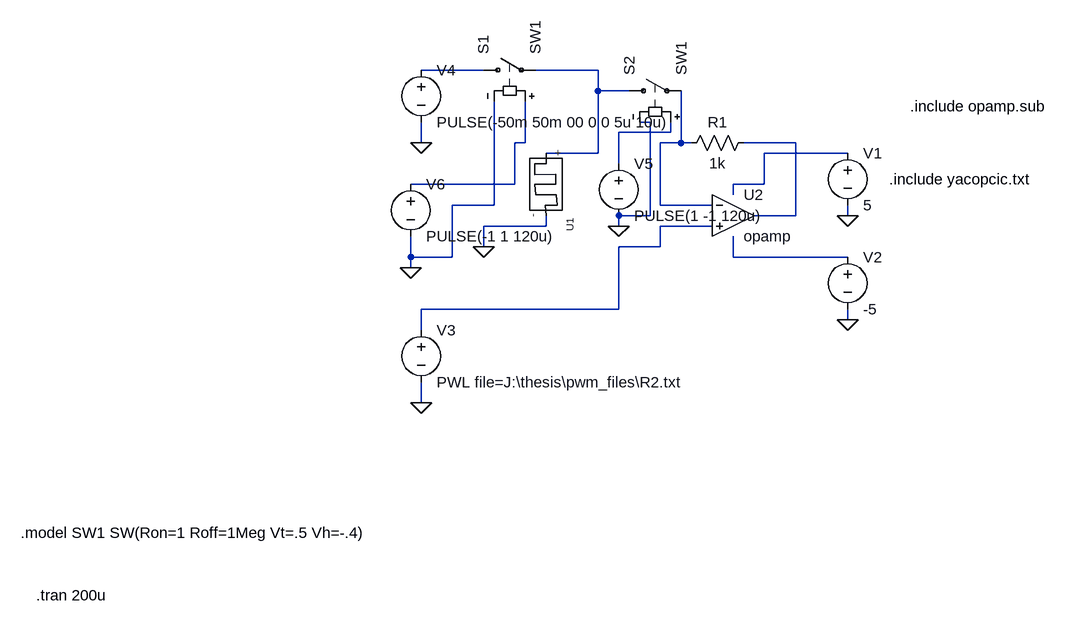
[diagram p0: schematic programmer_test.asc]
programmer_test.asc, the LTspice schematic file:
Version 4
SHEET 1 880 680
WIRE -528 -256 -624 -256
WIRE -352 -256 -448 -256
WIRE -352 -224 -352 -256
WIRE -304 -224 -352 -224
WIRE -272 -176 -288 -176
WIRE -240 -160 -240 -176
WIRE -240 -160 -320 -160
WIRE -624 -144 -624 -176
WIRE -464 -144 -464 -208
WIRE -464 -144 -480 -144
WIRE -224 -144 -224 -224
WIRE -224 -144 -256 -144
WIRE -208 -144 -224 -144
WIRE -48 -144 -128 -144
WIRE -352 -128 -352 -224
WIRE -352 -128 -432 -128
WIRE 32 -128 -96 -128
WIRE -320 -112 -320 -160
WIRE -480 -80 -480 -144
WIRE -480 -80 -640 -80
WIRE -96 -80 -96 -128
WIRE -96 -80 -144 -80
WIRE -144 -64 -144 -80
WIRE -512 -48 -512 -208
WIRE -512 -48 -576 -48
WIRE -256 -48 -256 -144
WIRE -176 -48 -256 -48
WIRE -272 -32 -272 -176
WIRE -272 -32 -320 -32
WIRE -48 -32 -48 -144
WIRE -48 -32 -112 -32
WIRE 32 -32 32 -48
WIRE -432 -16 -432 -32
WIRE -432 -16 -528 -16
WIRE -320 -16 -320 -32
WIRE -176 -16 -256 -16
WIRE -528 16 -528 -16
WIRE -256 16 -256 -16
WIRE -256 16 -320 16
WIRE -640 32 -640 0
WIRE -576 32 -576 -48
WIRE -576 32 -640 32
WIRE -144 32 -144 0
WIRE 32 32 -144 32
WIRE -640 48 -640 32
WIRE -320 112 -320 16
WIRE -320 112 -624 112
WIRE 32 128 32 112
WIRE -624 144 -624 112
WIRE -624 256 -624 224
FLAG -528 16 0
FLAG 32 -32 0
FLAG 32 128 0
FLAG -624 256 0
FLAG -640 48 0
FLAG -320 -16 0
FLAG -624 -144 0
SYMBOL memristormodel -432 -48 R90
SYMATTR InstName U1
SYMATTR Value MEM_YAKOPCIC
SYMBOL res -112 -160 R90
WINDOW 0 0 56 VBottom 2
WINDOW 3 32 56 VTop 2
SYMATTR InstName R1
SYMATTR Value 1k
SYMBOL voltage 32 -144 R0
WINDOW 123 0 0 Left 2
WINDOW 39 0 0 Left 2
SYMATTR InstName V1
SYMATTR Value 5
SYMBOL voltage 32 16 R0
WINDOW 123 0 0 Left 2
WINDOW 39 0 0 Left 2
SYMATTR InstName V2
SYMATTR Value -5
SYMBOL voltage -624 128 R0
WINDOW 123 0 0 Left 2
WINDOW 39 0 0 Left 2
SYMATTR InstName V3
SYMATTR Value PWL file=J:\thesis\pwm_files\R2.txt
SYMBOL sw -320 -224 R270
SYMATTR InstName S2
SYMATTR Value SW1
SYMBOL voltage -624 -272 R0
WINDOW 123 0 0 Left 2
WINDOW 39 0 0 Left 2
SYMATTR InstName V4
SYMATTR Value PULSE(-50m 50m 00 0 0 5u 10u)
SYMBOL voltage -320 -128 R0
WINDOW 123 0 0 Left 2
WINDOW 39 0 0 Left 2
SYMATTR InstName V5
SYMATTR Value PULSE(1 -1 120u)
SYMBOL voltage -640 -96 R0
WINDOW 123 0 0 Left 2
WINDOW 39 0 0 Left 2
SYMATTR InstName V6
SYMATTR Value PULSE(-1 1 120u)
SYMBOL sw -544 -256 R270
SYMATTR InstName S1
SYMATTR Value SW1
SYMBOL Opamps\\opamp -144 -96 R0
SYMATTR InstName U2
TEXT 96 -88 Left 2 !.include yacopcic.txt
TEXT -1216 552 Left 2 !.tran 200u
TEXT -1240 456 Left 2 !.model SW1 SW(Ron=1 Roff=1Meg Vt=.5 Vh=-.4)
TEXT 128 -200 Left 2 !.include opamp.sub

The netlist it stands for:
* programmer_test.asc
XU1 N002 0 M MEM_YAKOPCIC  ; pins + -
R1 N006 N005 1k
V1 N007 0 5
V2 N009 0 -5
V3 N008 0 PWL file=J:\thesis\pwm_files\R2.txt
S2 N002 N005 N003 0 SW1
V4 N001 0 PULSE(-50m 50m 00 0 0 5u 10u)
V5 N003 0 PULSE(1 -1 120u)
V6 N004 0 PULSE(-1 1 120u)
S1 N001 N002 N004 0 SW1
XU2 N005 N008 N006 opamp Aol=100K GBW=10Meg  ; pins invin noninvin out
.include yacopcic.txt
.tran 200u
.model SW1 SW(Ron=1 Roff=1Meg Vt=.5 Vh=-.4)
.include opamp.sub
.backanno
.end